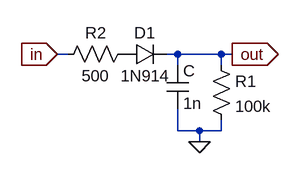
[diagram p0: schematic envelope_detector.asc]
envelope_detector.asc, the LTspice schematic file:
Version 4.1
SHEET 1 880 680
WIRE 80 112 64 112
WIRE 240 112 224 112
WIRE 304 112 240 112
WIRE 320 112 304 112
WIRE 240 128 240 112
WIRE 304 128 304 112
WIRE 240 224 240 192
WIRE 272 224 240 224
WIRE 304 224 304 208
WIRE 304 224 272 224
WIRE 272 240 272 224
FLAG 272 240 0
FLAG 64 112 in
IOPIN 64 112 In
FLAG 320 112 out
IOPIN 320 112 Out
SYMBOL diode 160 128 R270
WINDOW 0 32 32 VTop 2
WINDOW 3 0 32 VBottom 2
SYMATTR InstName D1
SYMATTR Value 1N914
SYMBOL cap 224 128 R0
SYMATTR InstName C
SYMATTR Value 1n
SYMBOL res 288 112 R0
SYMATTR InstName R1
SYMATTR Value 100k
SYMBOL res 64 128 R270
WINDOW 0 32 56 VTop 2
WINDOW 3 0 56 VBottom 2
SYMATTR InstName R2
SYMATTR Value 500

The netlist it stands for:
* envelope_detector.asc
D1 P001 out 1N914
C out 0 1n
R1 out 0 100k
R2 in P001 500
.model D D
.lib standard.dio
.backanno
.end